# Altium schematic sheet EE463_Sch.SchDoc
size A3
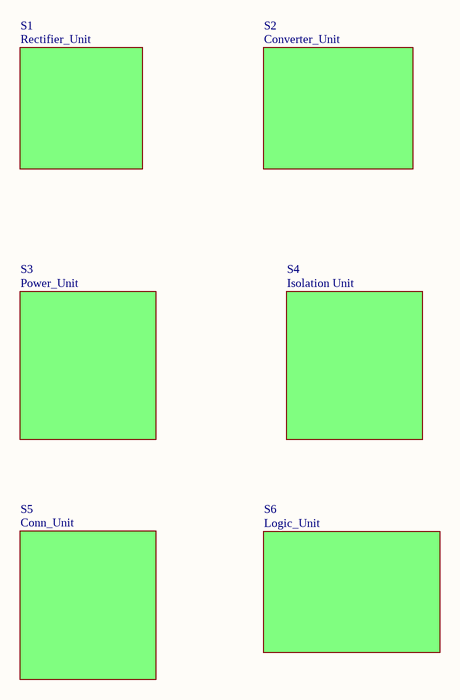
[diagram p0: EE463_Sch.SchDoc]

## Sub-sheets
S1 = Rectifier_Unit: no entries
S2 = Converter_Unit: no entries
S3 = Power_Unit: no entries
S4 = Isolation Unit: no entries
S5 = Conn_Unit: no entries
S6 = Logic_Unit: no entries

## Notes on the sheet
- Title
- Size:
- Date:
- A3
- Number:
- Time:
- Revision:
- Sheet
- of
- File: